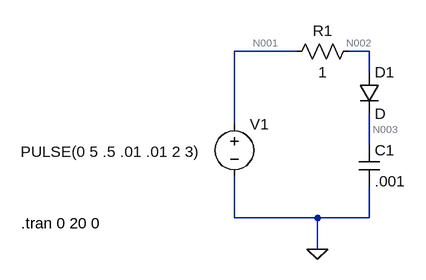
[diagram p0: schematic Draft 4.asc]
Draft 4.asc, the LTspice schematic file:
Version 4
SHEET 1 880 680
WIRE 192 16 96 16
WIRE 304 16 272 16
WIRE 304 48 304 16
WIRE 96 128 96 16
WIRE 304 160 304 112
WIRE 96 272 96 208
WIRE 224 272 96 272
WIRE 304 272 304 224
WIRE 304 272 224 272
WIRE 224 320 224 272
FLAG 224 320 0
SYMBOL voltage 96 112 R0
WINDOW 3 -329 58 Left 2
WINDOW 123 0 0 Left 0
WINDOW 39 0 0 Left 0
SYMATTR Value PULSE(0 5 .5 .01 .01 2 3)
SYMATTR InstName V1
SYMBOL diode 288 48 R0
SYMATTR InstName D1
SYMBOL cap 288 160 R0
SYMATTR InstName C1
SYMATTR Value .001
SYMBOL res 288 0 R90
WINDOW 0 0 56 VBottom 2
WINDOW 3 32 56 VTop 2
SYMATTR InstName R1
SYMATTR Value 1
TEXT -232 280 Left 2 !.tran 0 20 0

The netlist it stands for:
* Draft 4.asc
V1 N001 0 PULSE(0 5 .5 .01 .01 2 3)
D1 N002 N003 D
C1 N003 0 .001
R1 N002 N001 1
.model D D
.lib standard.dio
.tran 0 20 0
.backanno
.end

* Results of the author's LTspice run, read from the files saved beside the schematic
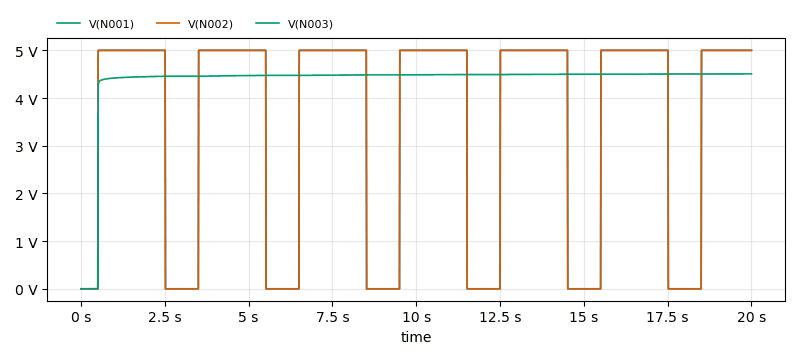
[diagram p1: Transient Analysis of Draft 4.asc, plotted from the saved traces]
* Transient Analysis, 1 run:
*   V(N001): min 0 V, max 5 V, average 3.389 V, rms 4.114 V, last 5 V
*   V(N002): min 0 V, max 5 V, average 3.389 V, rms 4.114 V, last 5 V
*   V(N003): min 0 V, max 4.507 V, average 4.369 V, rms 4.425 V, last 4.507 V